# EAGLE design CI_V_REV_A (EAGLE 7.2.0)
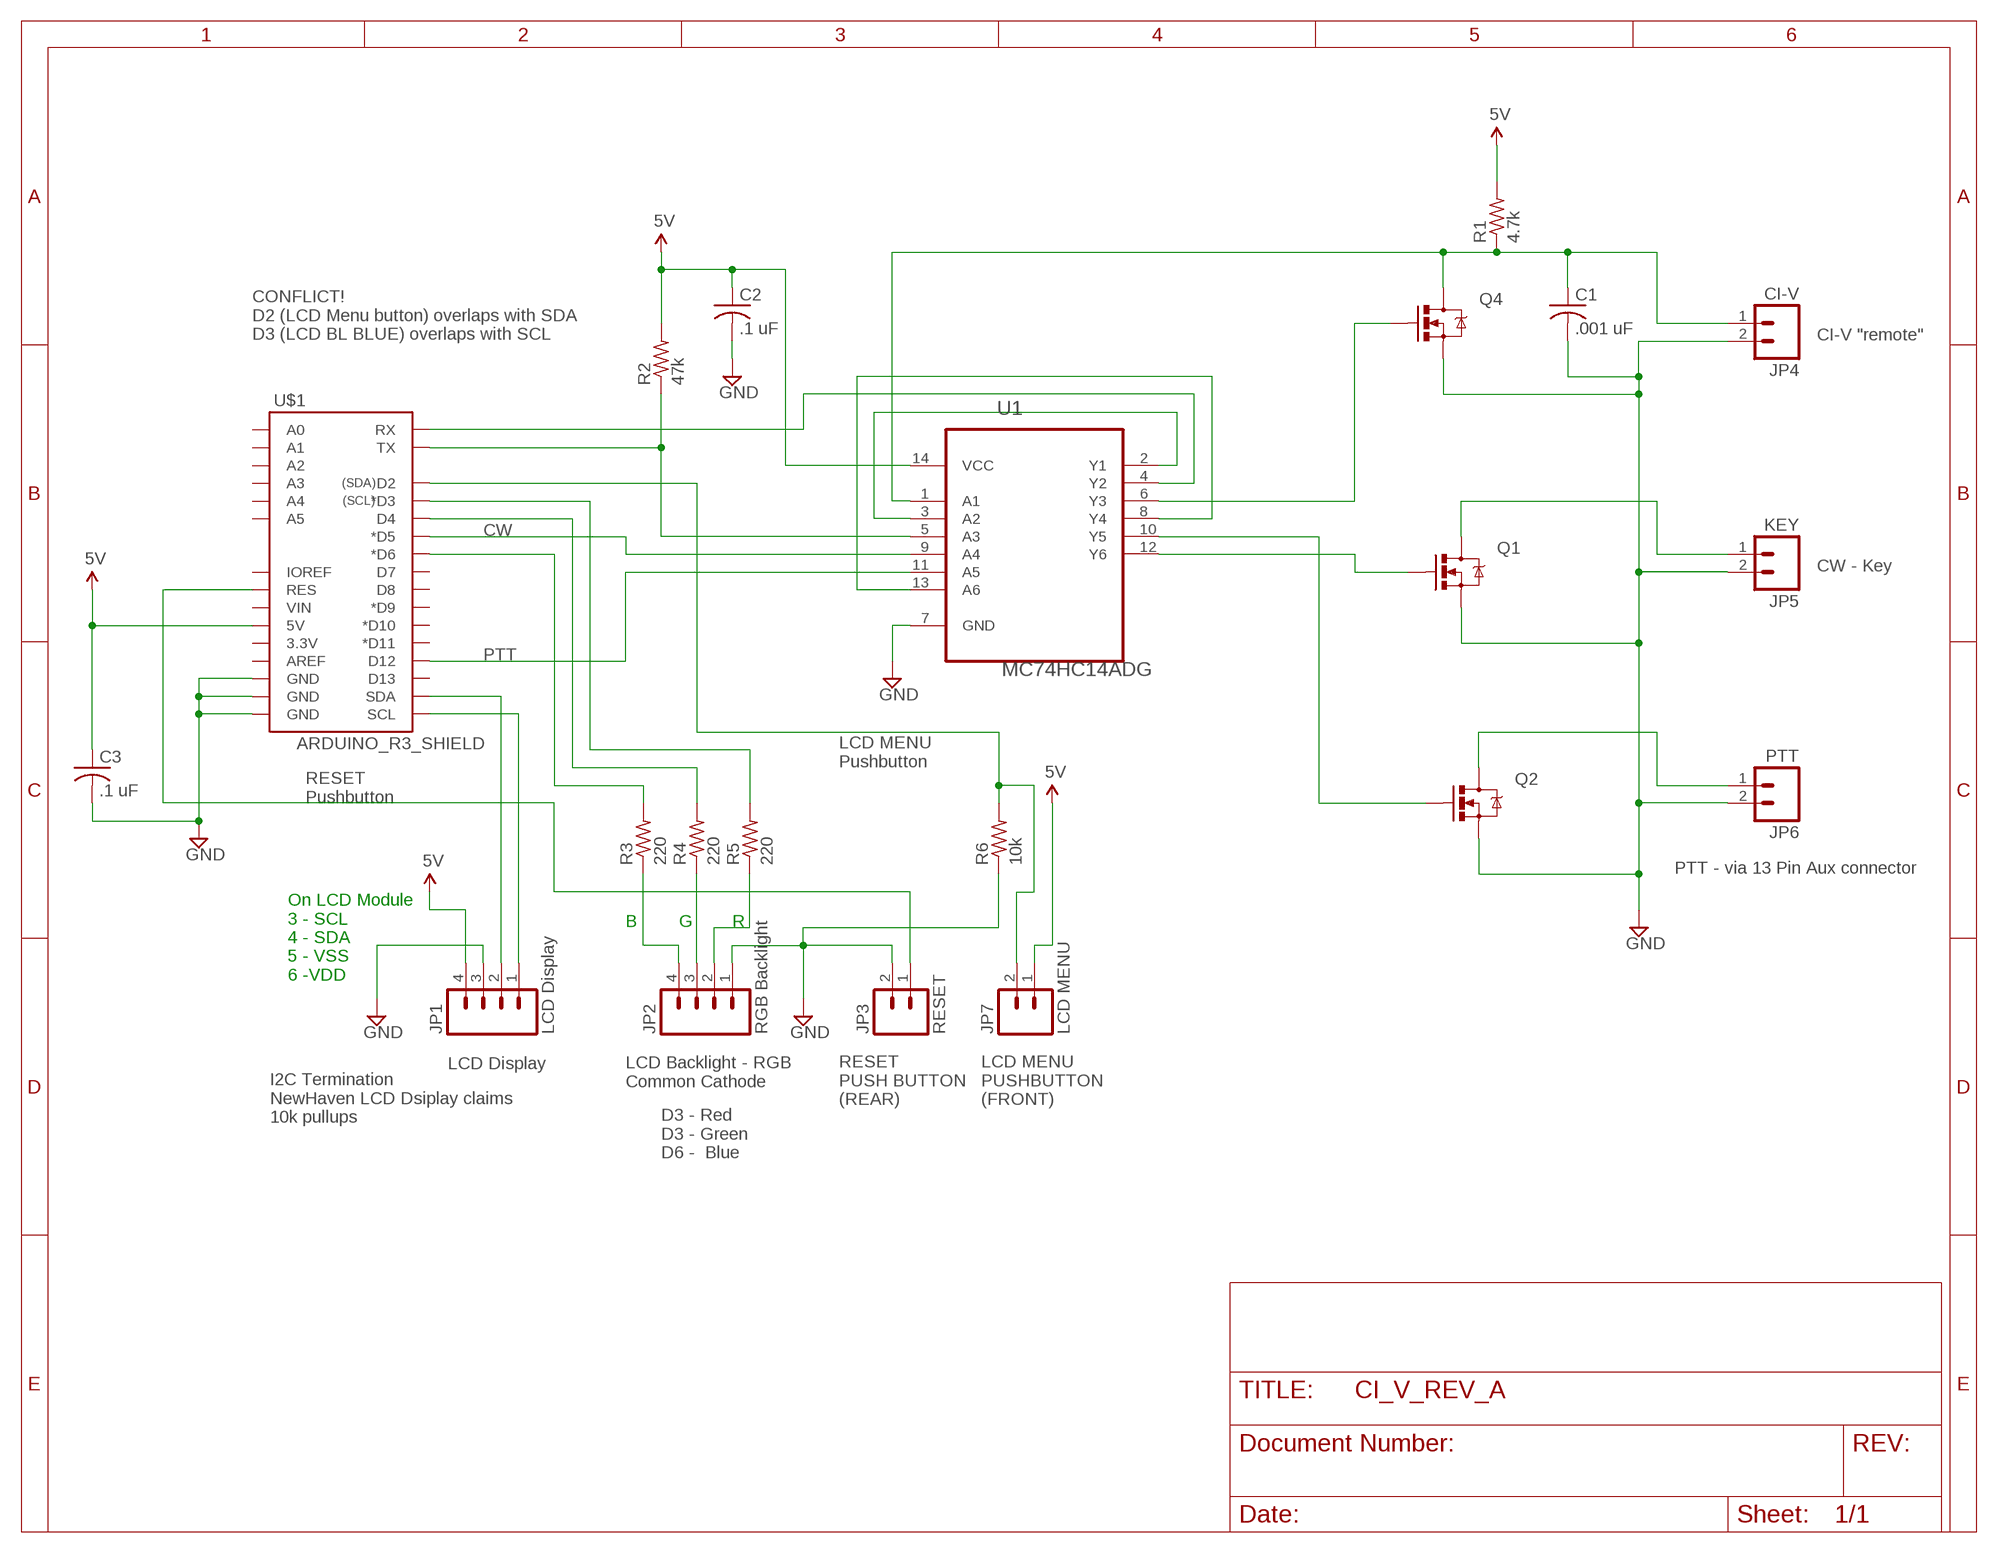
[diagram p0: schematic, sheet 1]

## Parts
C1  .001 uF  C-USC0805  [C0805]
C2  .1 uF  C-USC0805  [C0805]
C3  .1 uF  C-USC0805  [C0805]
JP1  LCD Display  M04PTH  [1X04]
JP2  RGB Backlight  M04PTH  [1X04]
JP3  RESET  M02PTH  [1X02]
JP4  CI-V  M02PTH  [1X02]
JP5  KEY  M02PTH  [1X02]
JP6  PTT  M02PTH  [1X02]
JP7  LCD MENU  M02PTH  [1X02]
Q1  MOSFET-NCHANNELBSS123LT1G  [SOT23-3]
Q2  MOSFET-NCHANNELBSS123LT1G  [SOT23-3]
Q4  MOSFET-NCHANNELBSS123LT1G  [SOT23-3]
R1  4.7k  R-US_R0805  [R0805]
R2  47k  R-US_R0805  [R0805]
R3  220  R-US_R0805  [R0805]
R4  220  R-US_R0805  [R0805]
R5  220  R-US_R0805  [R0805]
R6  10k  R-US_R0805  [R0805]
U1  MC74HC14ADG  [SOIC127P600X175-14N]
U$1  ARDUINO_R3_SHIELD  [UNO_R3_SHIELD]

## Nets
5V: C2.1 C3.1 JP1.4 JP7.1 R1.2 R2.2 U1.14(VCC) U$1.5V
CW: U1.9(A4) U$1.D5(*D5)
GND: C1.2 C2.2 C3.2 JP1.3 JP2.1 JP3.2 JP4.2 JP5.2 JP6.2 Q1.2(S) Q2.2(S) Q4.2(S) R6.1 U1.7(GND) U$1.GND@0(GND) U$1.GND@1(GND) U$1.GND@2(GND)
HARD_RX: U1.4(Y2) U$1.RX
HARD_TX: R2.1 U1.5(A3) U$1.TX
N$1: C1.1 JP4.1 Q4.3(D) R1.1 U1.1(A1)
N$2: JP5.1 Q1.3(D)
N$3: JP6.1 Q2.3(D)
N$4: Q4.1(G) U1.6(Y3)
N$5: JP2.4 R3.1
N$7: JP2.3 R4.1
N$8: U1.2(Y1) U1.3(A2)
N$9: Q1.1(G) U1.12(Y6)
N$10: Q2.1(G) U1.10(Y5)
N$12: JP1.1 U$1.SCL
N$13: U1.8(Y4) U1.13(A6)
N$14: JP1.2 U$1.SDA
N$15: JP2.2 R5.1
N$16: R3.2 U$1.D6(*D6)
N$17: R4.2 U$1.D4
N$18: R5.2 U$1.D3(*D3)
N$19: JP7.2 R6.2 U$1.D2
N$20: JP3.1 U$1.RES
PTT: U1.11(A5) U$1.D12
Unconnected: U$1.3.3V U$1.A0 U$1.A1 U$1.A2 U$1.A3 U$1.A4 U$1.A5 U$1.AREF U$1.D7 U$1.D8 U$1.D9(*D9) U$1.D10(*D10) U$1.D11(*D11) U$1.D13 U$1.IOREF U$1.VIN

## Notes on the sheet
- CI-V "remote"
- CONFLICT!
  D2 (LCD Menu button) overlaps with SDA
  D3 (LCD BL BLUE) overlaps with SCL
- CW - Key
- LCD MENU
  Pushbutton
- RESET
  Pushbutton
- PTT - via 13 Pin Aux connector
- B | G | R
- On LCD Module
  3 - SCL
  4 - SDA
  5 - VSS
  6 -VDD
- LCD Display
- LCD Backlight - RGB
  Common Cathode
- RESET
  PUSH BUTTON
  (REAR)
- LCD MENU
  PUSHBUTTON
  (FRONT)
- I2C Termination
  NewHaven LCD Dsiplay claims
  10k pullups
- D3 - Red
  D3 - Green
  D6 -  Blue

## Library data of the parts
C1-C3 = rcl:C-US: CAPACITOR, American symbol
JP1 JP2 = SparkFun-Connectors:M04: Header 4 Standard 4-pin 0.1" header. Use with straight break away headers (SKU : PRT-00116), right angle break away headers (PRT-00553), swiss pins (PRT-00743), machine pins (PRT-00117), and female headers (PRT-00115). Molex polarized connector foot print use with SKU : PRT-08231 with associated crimp pins and housings. 1MM SMD Version SKU: PRT-10208
JP3-JP7 = IHC:M02: Standard 2-pin 0.1" header. Use with - straight break away headers ( PRT-00116) - right angle break away headers (PRT-00553) - swiss pins (PRT-00743) - machine pins (PRT-00117) - female headers (PRT-00115) Molex polarized connector foot print use with: PRT-08233 with associated crimp pins and housings. 2.54_SCREWTERM for use with PRT-10571. 3.5mm Screw Terminal footprints for PRT-08084 5mm Screw Terminal footprints for use with PRT-08432
Q1 Q2 Q4 = SparkFun-DiscreteSemi:MOSFET-NCHANNEL: Common NMOSFET Parts MFG P/N Store ID Prod ID FDD8780 TRANS-09984 SI7820DN TRANS-11055 FDS6630A IC-08089 2N7002PW TRANS-11151 FQP30N06L COM-10213 TRANS-10060 BSS123LT1G TRANS-08345 BSS138 TRANS-00830 BS170 2N7000; PROD_ID: TRANS-08345
R1-R6 = rcl:R-US_: RESISTOR, American symbol
U1 = ON Semiconductor_By_element14_Batch_1:MC74HC14ADG: Hex Schmitt-Trigger Inverter; MPN: MC74HC14ADG; OC_FARNELL: 9666931; OC_NEWARK: 71J5595; PACKAGE: SOIC-14; SUPPLIER: ON SEMICONDUCTOR
U$1 = IHC:ARDUINO_R3_SHIELD: Shield form compatible with the Arduino Uno R3.

## Board
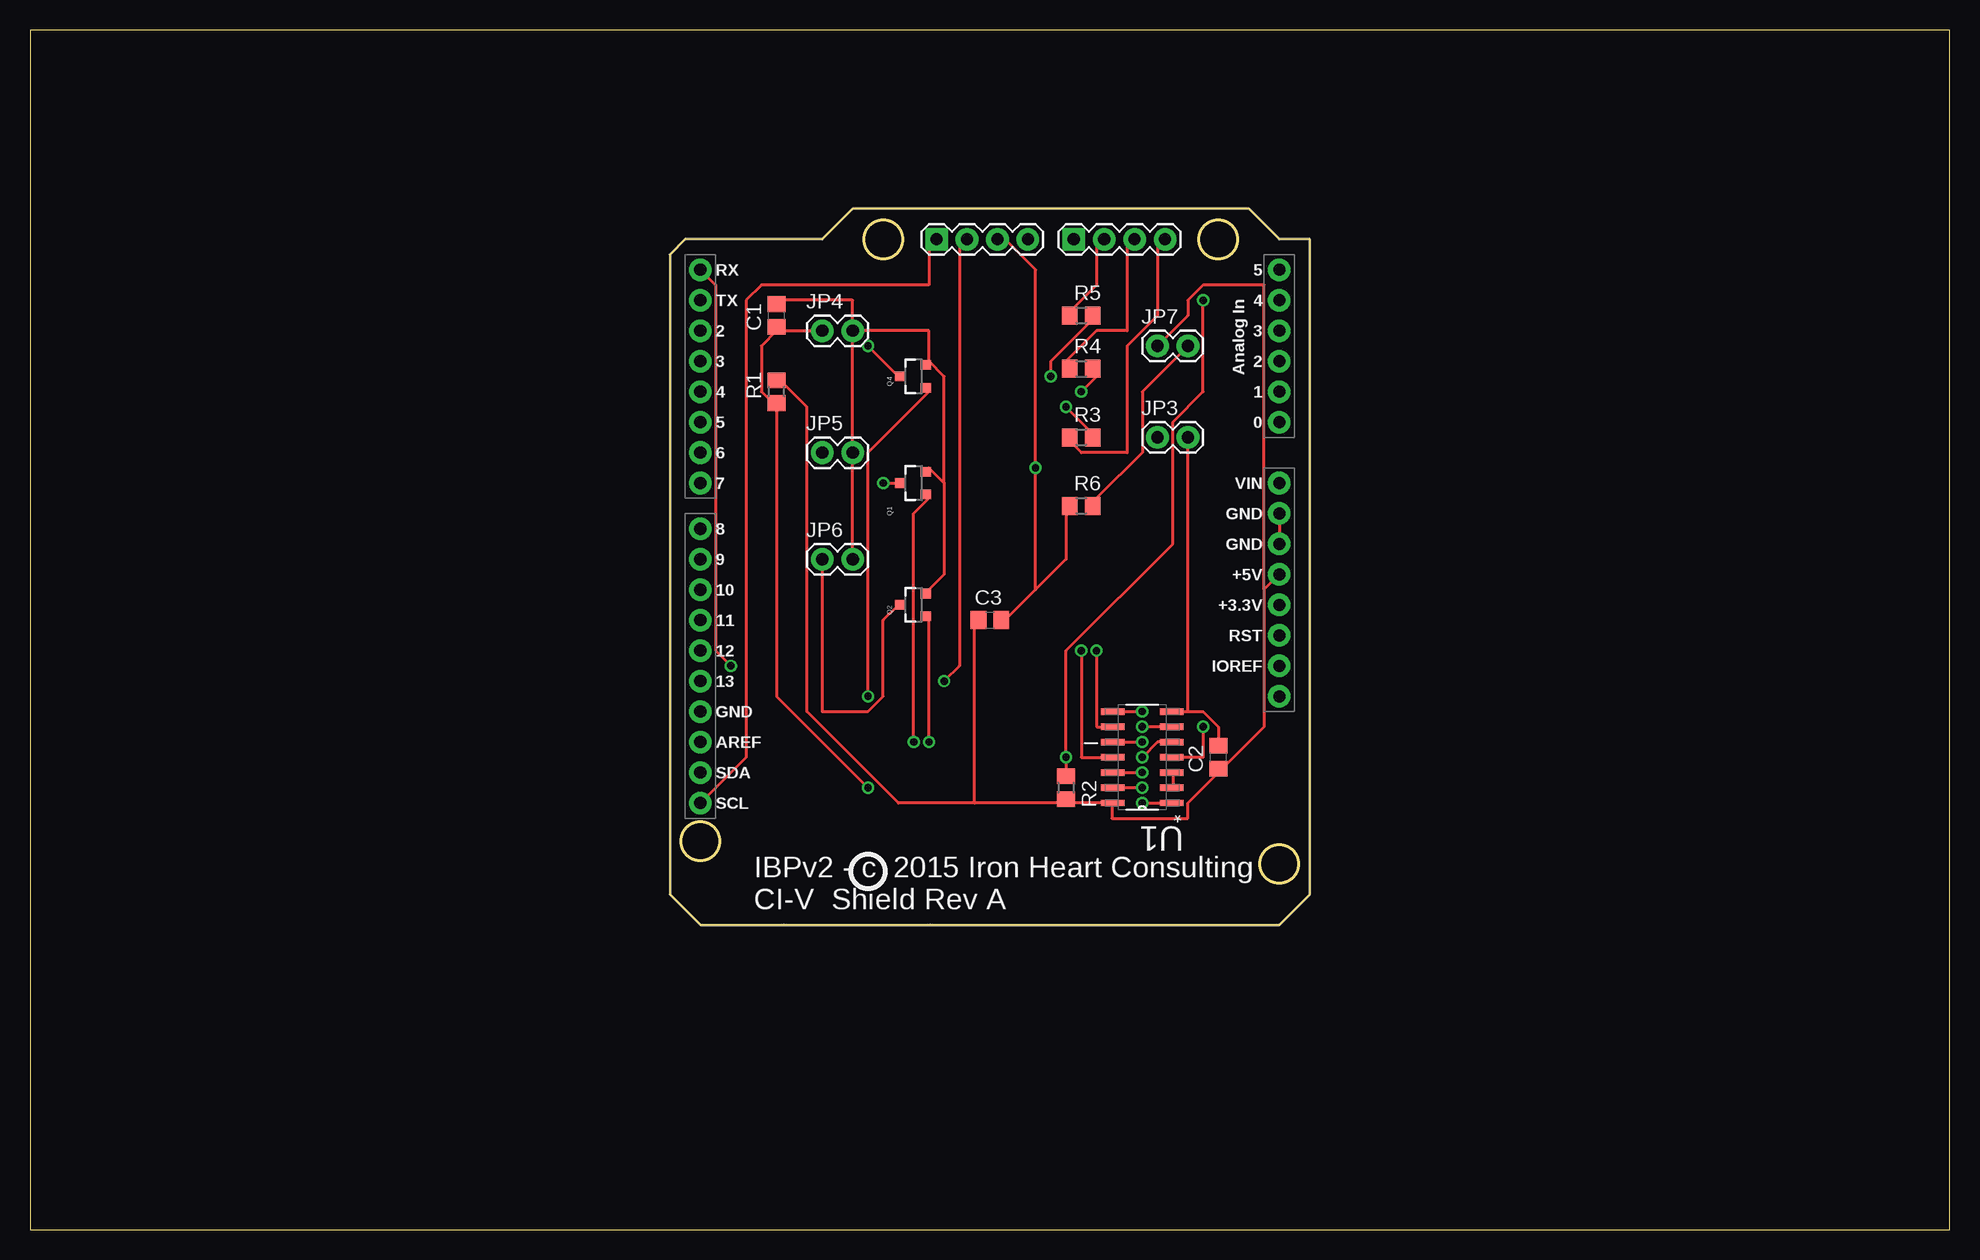
[diagram p1: board, top side]
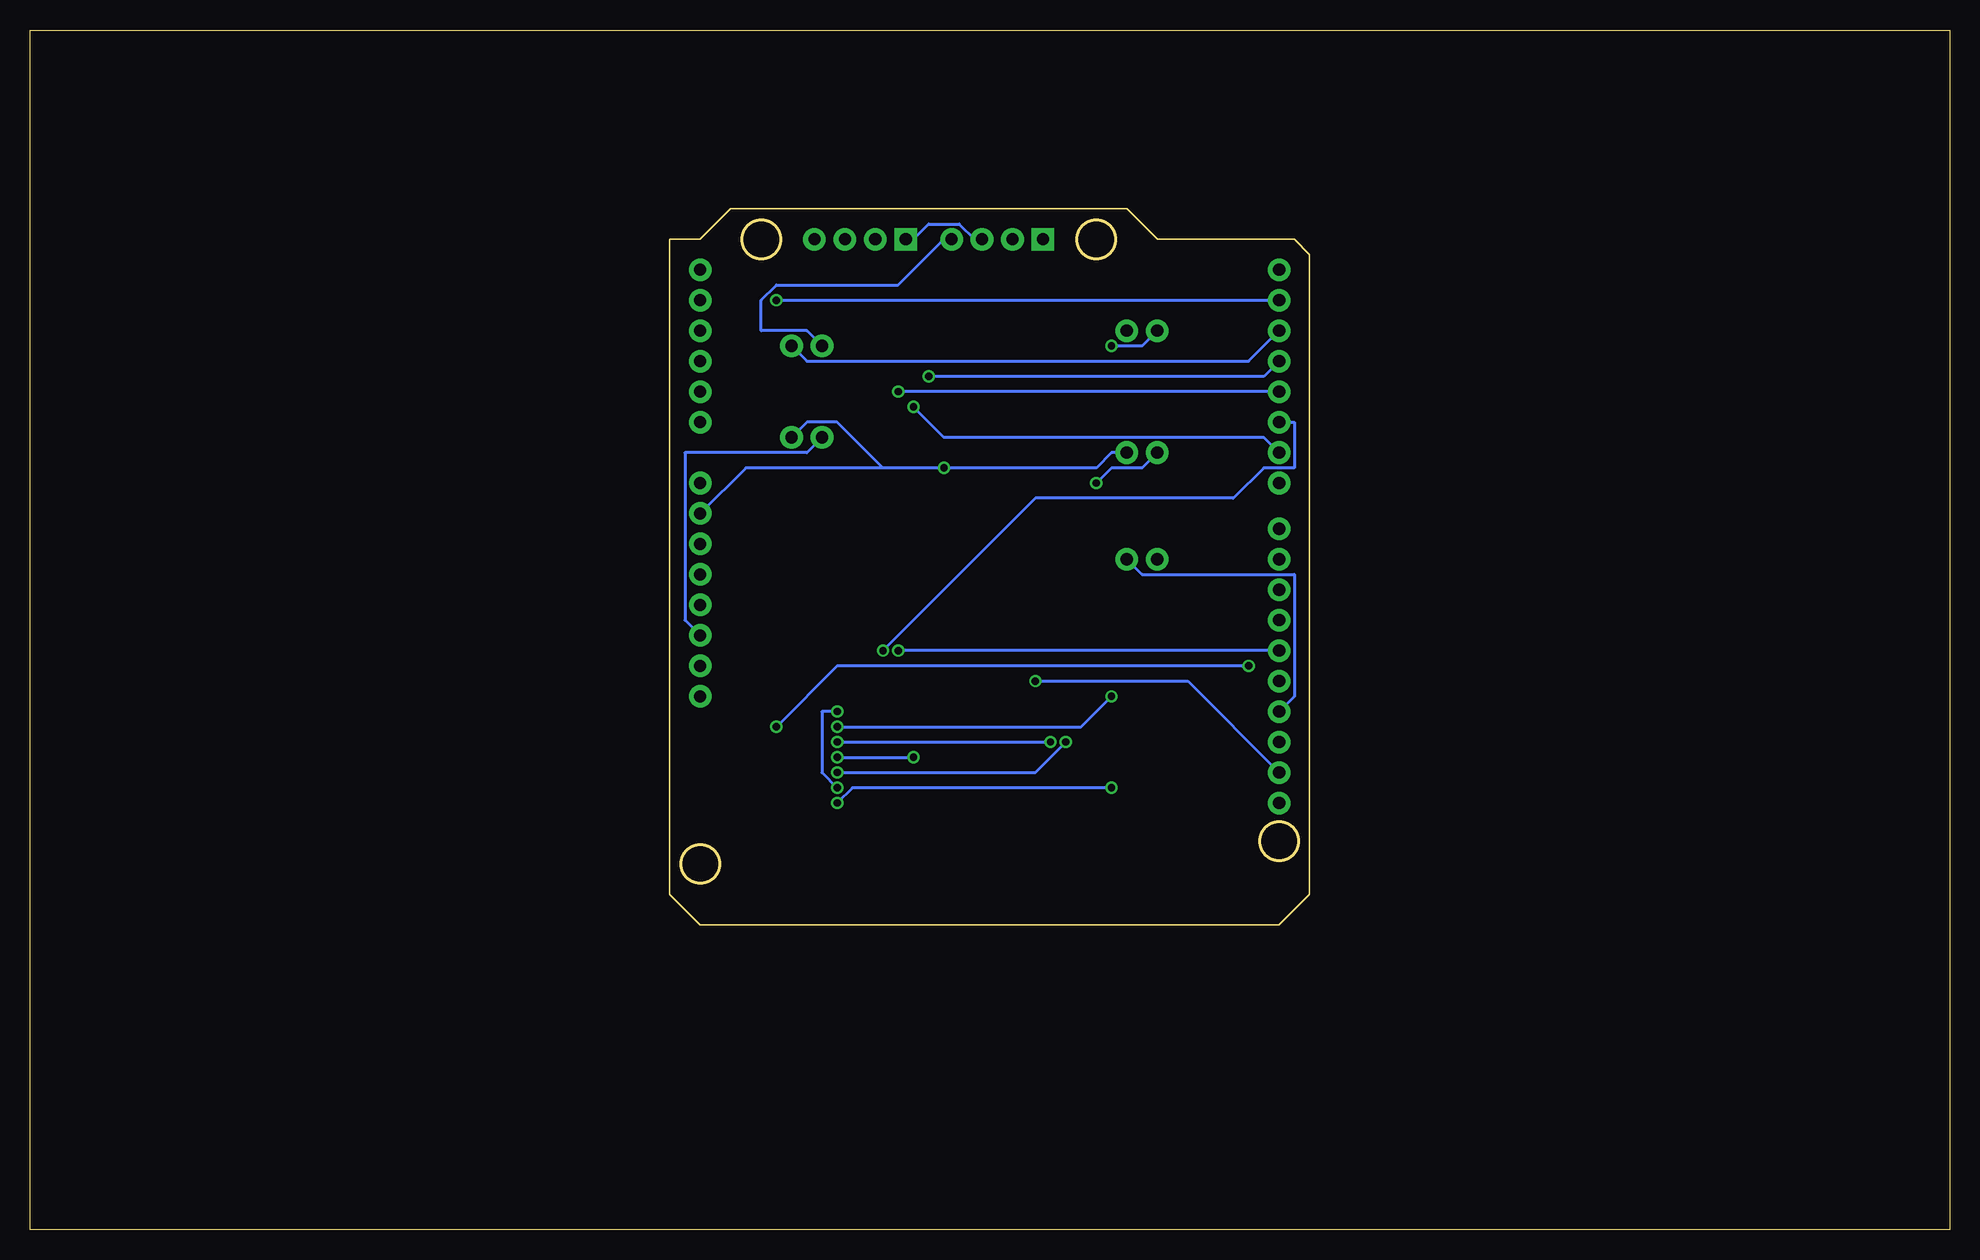
[diagram p2: board, bottom side, seen from below]

Size 160 x 100 mm. Coordinates in mm from the lower left corner, seen from the top.
Outline: 0,0 160,0 160,100 0,100 0,0
Outline: circle at 99.06,82.55 radius 1.6
Outline: circle at 55.88,32.38 radius 1.6
Outline: circle at 104.14,30.48 radius 1.6
Outline: circle at 71.12,82.55 radius 1.6
Copper layers (1*16): Top 0.035mm / dielectric 1.5mm / Bottom 0.035mm
Design rules "default": minimum track width 10mil, minimum drill 24mil, track to track 8mil, track to pad 8mil, pad to pad 8mil, via to via 8mil, smd to smd 8mil, copper to edge 40mil, drill to drill 8mil, minimum pad ring 10mil, minimum via ring 8mil, stop-mask expansion 4mil, vias tented up to drill 0mil, thermal gap 10mil

### Footprints (pad centres in the part's own frame; a part is rotated, then mirrored left to right if it is on the bottom)
C0805 = smd 1.3 x 1.5: 1 -0.95,0; 2 0.95,0
1X04 = drill 1.016 pad 1.88 square: 1 0,0 | drill 1.016 pad 1.88: 2 2.54,0; 3 5.08,0; 4 7.62,0
1X02 = drill 1.016 pad 1.88: 1 0,0; 2 2.54,0
SOT23-3 = smd 0.8 x 0.9: 1 -0.95,-1; 2 0.95,-1; 3 0,1.1
R0805 = smd 1.3 x 1.5: 1 -0.95,0; 2 0.95,0
SOIC127P600X175-14N = smd 1.981 x 0.533: 1 -2.464,3.81; 2 -2.464,2.54; 3 -2.464,1.27; 4 -2.464,0; 5 -2.464,-1.27; 6 -2.464,-2.54; 7 -2.464,-3.81; 8 2.464,-3.81; 9 2.464,-2.54; 10 2.464,-1.27; 11 2.464,0; 12 2.464,1.27; 13 2.464,2.54; 14 2.464,3.81
UNO_R3_SHIELD = drill 1.016 pad 1.88: 3.3V 50.8,26.67; 5V 50.8,29.21; A0 50.8,41.91; A1 50.8,44.45; A2 50.8,46.99; A3 50.8,49.53; A4 50.8,52.07; A5 50.8,54.61; AREF 2.54,15.24; D2 2.54,49.53; D3 2.54,46.99; D4 2.54,44.45; D5 2.54,41.91; D6 2.54,39.37; D7 2.54,36.83; D8 2.54,33.02; D9 2.54,30.48; D10 2.54,27.94; D11 2.54,25.4; D12 2.54,22.86; D13 2.54,20.32; GND@0 50.8,31.75; GND@1 50.8,34.29; GND@2 2.54,17.78; IOREF 50.8,21.59; NC 50.8,19.05; RES 50.8,24.13; RX 2.54,54.61; SCL 2.54,10.16; SDA 2.54,12.7; TX 2.54,52.07; VIN 50.8,36.83

### Placement (x,y rotation side)
C1  62.23,76.2 90 top
C2  99.06,39.37 90 top
C3  80.01,50.8 0 top
JP1  75.56,82.55 0 top
JP2  87,82.55 0 top
JP3  93.98,66.04 0 top
JP4  66.04,74.93 0 top
JP5  66.04,64.77 0 top
JP6  66.04,55.88 0 top
JP7  93.98,73.66 0 top
Q1  73.66,62.23 90 top
Q2  73.66,52.07 90 top
Q4  73.66,71.12 90 top
R1  62.23,69.85 90 top
R2  86.36,36.83 270 top
R3  87.63,66.04 0 top
R4  87.63,71.75 0 top
R5  87.63,76.2 0 top
R6  87.63,60.33 0 top
U1  92.71,39.37 180 top
U$1  53.34,25.4 0 top

### Tracks (layer width: path | path; a pad name or v marks a point on that pad's centre or on a via)
5V
  Top 0.254: 99.06,38.1 102.87,41.91 102.87,53.34 | U$1.5V 102.87,53.34 | 90.17,35.56 86.36,35.56 | 86.36,35.56 78.74,35.56 | 78.74,35.56 72.39,35.56 64.77,43.18 64.77,68.58 62.23,71.12 R1.2 | 86.36,35.56 R2.2 | 78.74,35.56 78.74,50.8 C3.1 | 99.06,38.1 96.52,35.56 96.52,34.29 90.17,34.29 90.17,35.56 | 99.06,38.1 C2.1 | 90.17,35.56 U1.14 | JP7.1 96.52,76.2 96.52,77.47 97.79,78.74 102.87,78.74 102.87,53.34
  Bottom 0.254: JP7.1 95.25,74.93 99.06,74.93 99.06,77.47 97.79,78.74 87.63,78.74 83.82,82.55 JP1.4
CW  (via drill 0.61)
  Top 0.254: U1.9 88.9,41.91 v88.9,48.26
  Bottom 0.254: v88.9,48.26 76.2,60.96 59.69,60.96 57.15,63.5 54.61,63.5 54.61,67.31 U$1.D5
GND  (via drill 0.61)
  Top 0.254: 83.82,53.34 86.36,55.88 86.36,59.69 R6.1 | 83.82,53.34 81.28,50.8 C3.2 | 83.82,53.34 v83.82,63.5 83.82,80.01 81.28,82.55 JP1.3 | JP4.2 68.58,77.47 62.23,77.47 C1.2 | 76.2,62.23 76.2,54.61 74.93,53.34 Q2.2 | 76.2,62.23 74.93,63.5 Q1.2 | 74.93,72.39 76.2,71.12 76.2,62.23 | JP4.2 74.93,74.93 74.93,72.39 | 74.93,72.39 Q4.2 | C2.2 99.06,41.91 97.79,43.18 96.52,43.18 | U1.7 96.52,43.18 | 96.52,43.18 JP3.2 | U$1.GND@1 U$1.GND@0 | JP6.2 JP5.2 JP4.2
  Bottom 0.254: JP1.3 81.28,82.55 82.55,83.82 85.09,83.82 86.36,82.55 JP2.1 | U$1.GND@2 54.61,44.45 54.61,54.61 67.31,54.61 JP6.2 | U$1.GND@1 100.33,63.5 88.9,63.5 | 88.9,63.5 v83.82,63.5 71.12,63.5 69.85,64.77 JP5.2 | JP3.2 95.25,67.31 92.71,67.31 88.9,63.5
HARD_RX  (via drill 0.61)
  Top 0.254: U1.4 97.79,39.37 v97.79,41.91 | v58.42,46.99 57.15,48.26 57.15,78.74 U$1.RX
  Bottom 0.254: v97.79,41.91 92.71,46.99 v58.42,46.99
HARD_TX  (via drill 0.61)
  Top 0.254: R2.1 v86.36,39.37 86.36,48.26 95.25,57.15 95.25,67.31 97.79,69.85 v97.79,77.47 | v92.71,39.37 93.98,40.64 U1.5 95.25,40.64
  Bottom 0.254: v92.71,39.37 v86.36,39.37 | v97.79,77.47 U$1.TX
N$1  (via drill 0.61)
  Top 0.254: v69.85,73.66 72.39,71.12 Q4.3 | 62.23,68.58 60.96,69.85 60.96,73.66 62.23,74.93 | v92.71,35.56 U1.1 95.25,35.56 | v69.85,36.83 62.23,44.45 62.23,68.58 | 62.23,68.58 R1.1 | 62.23,74.93 JP4.1 | 62.23,74.93 C1.1
  Bottom 0.254: v69.85,73.66 67.31,73.66 JP4.1 | v92.71,35.56 91.44,36.83 v69.85,36.83
N$2  (via drill 0.61)
  Top 0.254: v71.12,62.23 Q1.3
  Bottom 0.254: v71.12,62.23 69.85,63.5 67.31,63.5 JP5.1
N$3
  Top 0.254: JP6.1 66.04,43.18 69.85,43.18 71.12,44.45 71.12,50.8 72.39,52.07 Q2.3
N$4  (via drill 0.61)
  Top 0.254: v69.85,44.45 69.85,64.77 74.93,69.85 Q4.1 | v92.71,41.91 U1.6 95.25,41.91
  Bottom 0.254: v69.85,44.45 72.39,41.91 v92.71,41.91
N$5
  Top 0.254: R3.1 86.36,66.04 87.63,64.77 91.44,64.77 91.44,73.66 93.98,76.2 93.98,82.55 JP2.4
N$7
  Top 0.254: R4.1 86.36,72.39 88.9,74.93 91.44,74.93 91.44,82.55 JP2.3
N$8
  Top 0.254: U1.2 95.25,36.83 95.25,38.1 U1.3
N$9  (via drill 0.61)
  Top 0.254: v73.66,40.64 73.66,59.69 74.93,60.96 Q1.1 | v92.71,38.1 U1.12 90.17,38.1
  Bottom 0.254: v73.66,40.64 76.2,38.1 v92.71,38.1
N$10  (via drill 0.61)
  Top 0.254: v74.93,40.64 74.93,50.8 Q2.1 | v92.71,40.64 U1.10 90.17,40.64
  Bottom 0.254: v92.71,40.64 v74.93,40.64
N$12
  Top 0.254: U$1.SCL 59.69,39.37 59.69,77.47 60.96,78.74 74.93,78.74 74.93,82.55 JP1.1
N$13  (via drill 0.61)
  Top 0.254: v92.71,36.83 U1.13 90.17,36.83 | v92.71,43.18 U1.8 90.17,43.18
  Bottom 0.254: v92.71,36.83 93.98,38.1 93.98,43.18 v92.71,43.18
N$14  (via drill 0.61)
  Top 0.254: v76.2,45.72 77.47,46.99 77.47,82.55 JP1.2
  Bottom 0.254: U$1.SDA 63.5,45.72 v76.2,45.72
N$15
  Top 0.254: R5.1 86.36,76.2 88.9,78.74 88.9,82.55 JP2.2
N$16  (via drill 0.61)
  Top 0.254: v86.36,68.58 88.9,66.04 R3.2
  Bottom 0.254: v86.36,68.58 83.82,66.04 57.15,66.04 U$1.D6
N$17  (via drill 0.61)
  Top 0.254: v87.63,69.85 88.9,71.12 R4.2
  Bottom 0.254: U$1.D4 v87.63,69.85
N$18  (via drill 0.61)
  Top 0.254: v85.09,71.12 85.09,72.39 88.9,76.2 R5.2
  Bottom 0.254: v85.09,71.12 57.15,71.12 U$1.D3
N$19
  Top 0.254: JP7.2 92.71,69.85 92.71,64.77 88.9,60.96 R6.2
  Bottom 0.254: U$1.D2 58.42,72.39 95.25,72.39 JP7.2
N$20
  Bottom 0.254: U$1.RES 105.41,50.8 105.41,64.77 95.25,64.77 JP3.1
PTT  (via drill 0.61)
  Top 0.254: U1.11 87.63,39.37 v87.63,48.26
  Bottom 0.254: U$1.D12 v87.63,48.26

### Text on the board
tPlace: IBPv2 - c 2015 Iron Heart Consulting / CI-V Shield Rev A